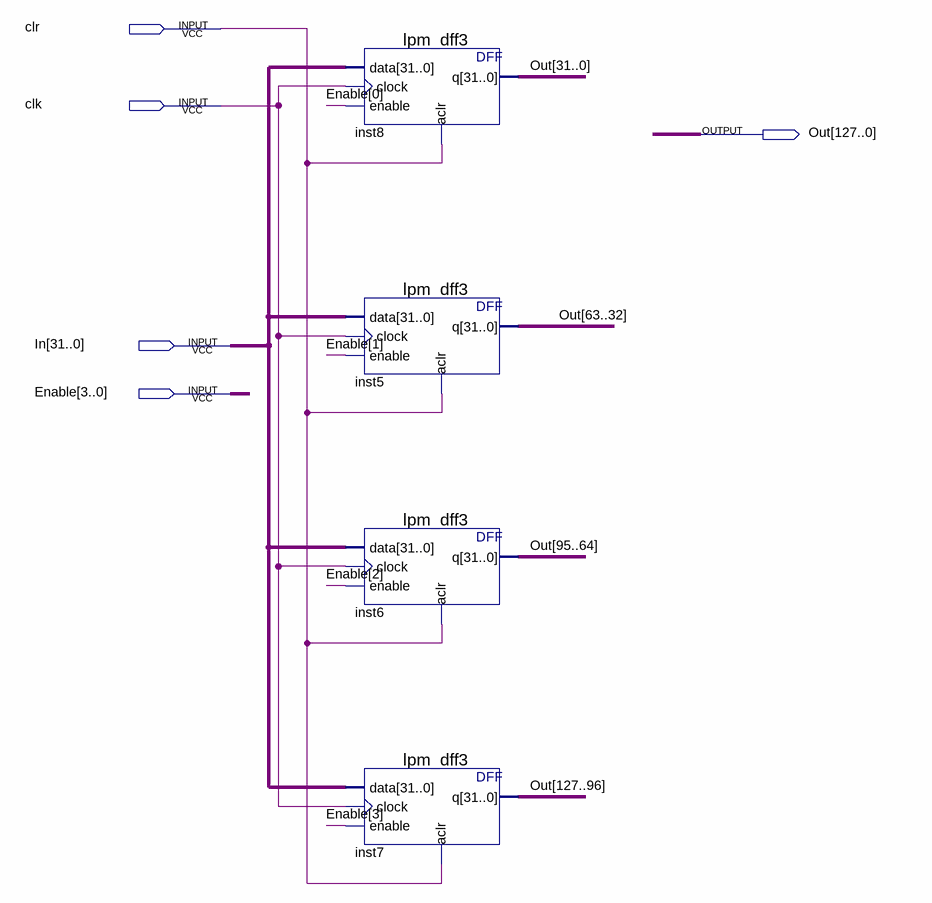
[diagram p0: schematic sheet]
// Quartus schematic 4reg.bdf as structural Verilog: 4 symbols, 5 pins
module \4reg  (
  input  clr,
  input  clk,
  input  [31:0] In,
  input  [3:0] Enable,
  output [127:0] Out
);

  lpm_dff3 inst8 (.data(In), .clock(clk), .enable(Enable[0]), .aclr(clr), .q(Out[31:0]));
  lpm_dff3 inst5 (.data(In), .clock(clk), .enable(Enable[1]), .aclr(clr), .q(Out[63:32]));
  lpm_dff3 inst6 (.data(In), .clock(clk), .enable(Enable[2]), .aclr(clr), .q(Out[95:64]));
  lpm_dff3 inst7 (.data(In), .clock(clk), .enable(Enable[3]), .aclr(clr), .q(Out[127:96]));
endmodule
